# EAGLE design ultrasonic_send (EAGLE 6.1)
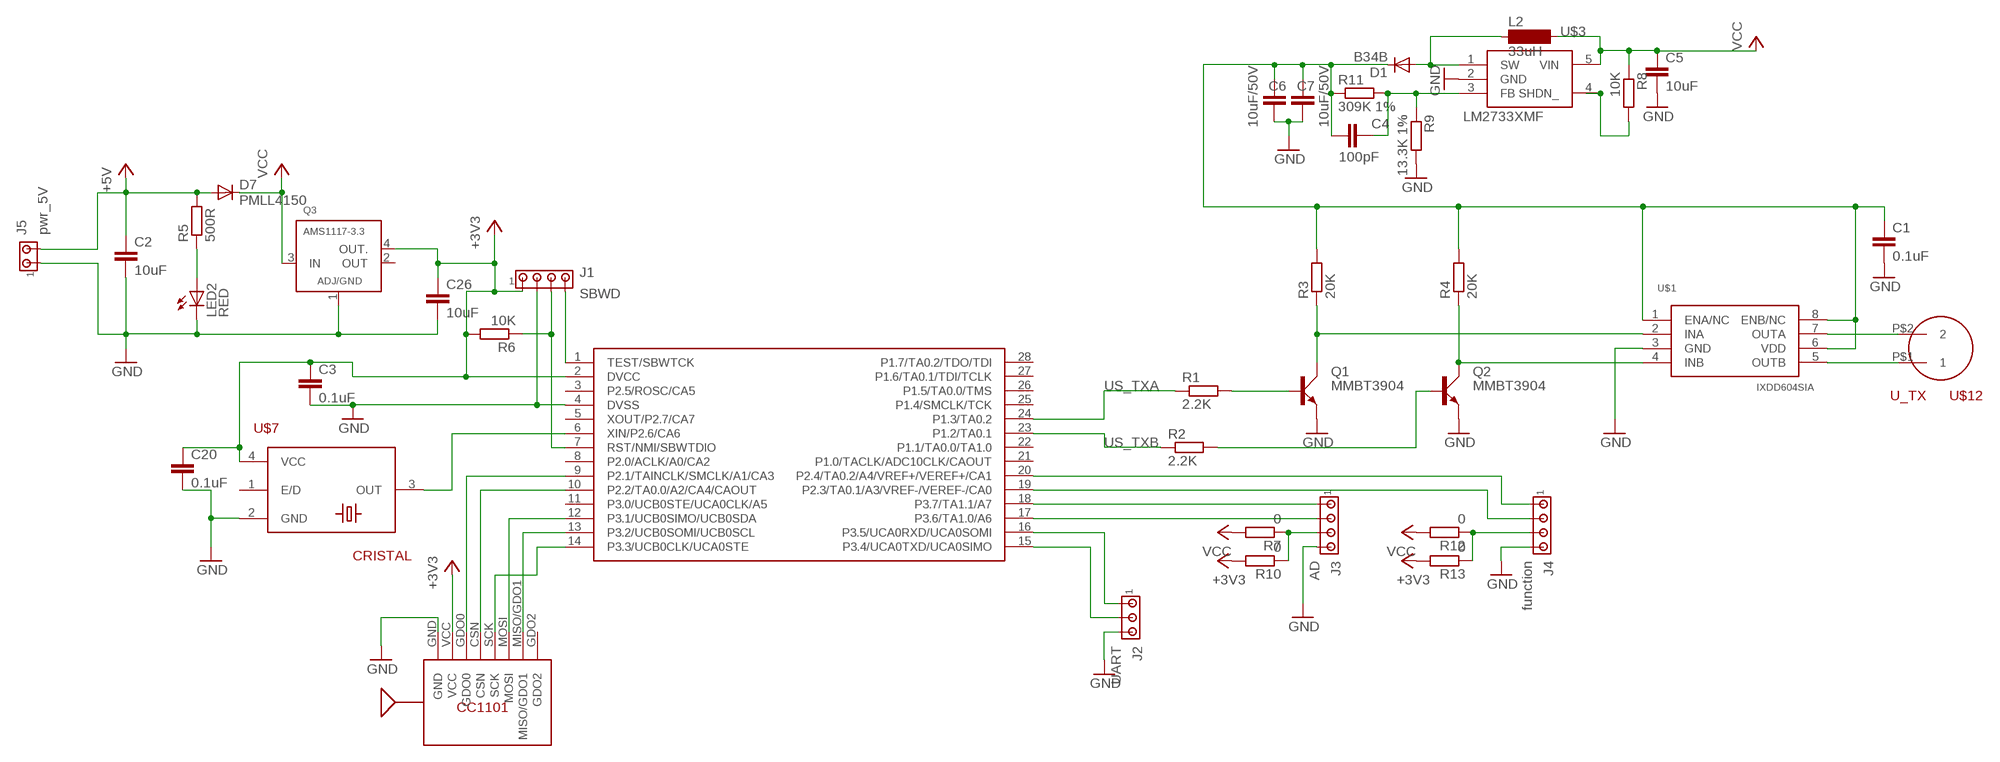
[diagram p0: schematic, sheet 1]

## Parts
C1  0.1uF  C-EUC0805  [C0805]
C2  10uF  C-EUC0805  [C0805]
C3  0.1uF  C-EUC0805  [C0805]
C4  100pF  C-EUC0805  [C0805]
C5  10uF  C-EUC0805  [C0805]
C6  10uF/50V  C-EUC1210  [C1210]
C7  10uF/50V  C-EUC1210  [C1210]
C20  0.1uF  C-EUC0805  [C0805]
C26  10uF  C-EUC0805  [C0805]
D1  B34B  DIODE-GF1  [GF1]
D7  PMLL4150  [SOD80C]
J1  SBWD  MTA04-100  [10X04MTA]
J2  UART  MTA03-100  [10X03MTA]
J3  AD  MTA04-100  [10X04MTA]
J4  function  MTA04-100  [10X04MTA]
J5  pwr_5V  MTA02-100  [10X02MTA]
L2  33uH  MS85  [MS85]
LED2  RED  LEDSML0805  [SML0805]
Q1  MMBT3904  [SOT23]
Q2  MMBT3904  [SOT23]
Q3  AMS1117-3.3  TLV1117  [SOT223-4]
R1  2.2K  R-EU_R0805  [R0805]
R2  2.2K  R-EU_R0805  [R0805]
R3  20K  R-EU_R0603  [R0603]
R4  20K  R-EU_R0603  [R0603]
R5  500R  R-EU_R0603  [R0603]
R6  10K  R-EU_R0603  [R0603]
R7  0  R-EU_R0603  [R0603]
R8  10K  R-EU_R0603  [R0603]
R9  13.3K 1%  R-EU_R0603  [R0603]
R10  0  R-EU_R0603  [R0603]
R11  309K 1%  R-EU_R0603  [R0603]
R12  0  R-EU_R0603  [R0603]
R13  0  R-EU_R0603  [R0603]
U$1  IXDD604SIA  [SO8]
U$2  MSP430F2112  [PW_R-PDSO-G28]
U$3  LM2733XMF  [SOT23-DBV]
U$4  CC1101  [CC1101]
U$7  CRISTAL  [CTS406]
U$12  U_TX  ULTRASONIC  [ULTRASONIC]

## Nets
+3V3: C3.1 C20.1 C26.1 J1.1 Q3.4(OUT.) R6.2 R10.2 R13.2 U$2.2(DVCC) U$4.VCC U$7.4(VCC)
+5V: C2.1 D7.A J5.2 R5.2
GND: C1.2 C2.2 C3.2 C5.2 C6.2 C7.2 C20.2 C26.2 J1.2 J2.3 J3.4 J4.4 J5.1 LED2.C Q1.2(E) Q2.2(E) Q3.1(ADJ/GND) R9.2 U$1.3(GND) U$2.4(DVSS) U$3.2(GND) U$4.GND U$7.2(GND)
N$1: Q1.1(B) R1.2
N$2: Q2.1(B) R2.2
N$3: Q1.3(C) R3.1 U$1.2(INA)
N$4: Q2.3(C) R4.1 U$1.4(INB)
N$5: J1.4 U$2.1(TEST/SBWTCK)
N$6: LED2.A R5.1
N$7: U$2.6(XIN/P2.6/CA6) U$7.3(OUT)
N$8: C1.1 C4.1 C6.1 C7.1 D1.C R3.2 R4.2 R11.1 U$1.1(ENA/NC) U$1.6(VDD) U$1.8(ENB/NC)
N$9: J4.3 R12.1 R13.1
N$10: J1.3 R6.1 U$2.7(RST/NMI/SBWTDIO)
N$11: U$2.9(P2.1/TAINCLK/SMCLK/A1/CA3) U$4.GDO0
N$12: U$2.10(P2.2/TA0.0/A2/CA4/CAOUT) U$4.CSN
N$13: U$2.12(P3.1/UCB0SIMO/UCB0SDA) U$4.MOSI
N$14: U$2.13(P3.2/UCB0SOMI/UCB0SCL) U$4.MISO/GDO1
N$15: U$2.14(P3.3/UCB0CLK/UCA0STE) U$4.SCK
N$16: J2.1 U$2.16(P3.5/UCA0RXD/UCA0SOMI)
N$17: J2.2 U$2.15(P3.4/UCA0TXD/UCA0SIMO)
N$18: J3.1 U$2.18(P3.7/TA1.1/A7)
N$19: J3.2 U$2.17(P3.6/TA1.0/A6)
N$20: J3.3 R7.1 R10.1
N$36: R8.2 U$3.4(SHDN_)
N$38: D1.A L2.1 U$3.1(SW)
N$39: C4.2 R9.1 R11.2 U$3.3(FB)
N$42: J4.1 U$2.20(P2.4/TA0.2/A4/VREF+/VEREF+/CA1)
N$54: U$1.7(OUTA) U$12.P$2
N$55: U$1.5(OUTB) U$12.P$1
N$56: J4.2 U$2.19(P2.3/TA0.1/A3/VREF-/VEREF-/CA0)
US_TXA: R1.1 U$2.24(P1.3/TA0.2)
US_TXB: R2.1 U$2.23(P1.2/TA0.1)
VCC: C5.1 D7.C L2.2 Q3.3(IN) R7.2 R8.1 R12.2 U$3.5(VIN)
Unconnected: U$2.3(P2.5/ROSC/CA5) U$2.5(XOUT/P2.7/CA7) U$2.8(P2.0/ACLK/A0/CA2) U$2.11(P3.0/UCB0STE/UCA0CLK/A5) U$2.21(P1.0/TACLK/ADC10CLK/CAOUT) U$2.22(P1.1/TA0.0/TA1.0) U$2.25(P1.4/SMCLK/TCK) U$2.26(P1.5/TA0.0/TMS) U$2.27(P1.6/TA0.1/TDI/TCLK) U$2.28(P1.7/TA0.2/TDO/TDI) U$4.GDO2 U$7.1(E/D)

## Power pins joined to a net without a drawn wire
OUT: Q3.2(OUT)

## Library data of the parts
C1-C7 C20 C26 = resistor:C-EU: CAPACITOR, European symbol
D1 = diode:DIODE-: DIODE
D7 = diode:PMLL4150: DIODE high speed
J1 J3 J4 = con-amp:MTA04-100: AMP connector
J2 = con-amp:MTA03-100: AMP connector
J5 = con-amp:MTA02-100: AMP connector
L2 = inductor-neosid:MS85: INDUCTOR SMD power inductor; OC_FARNELL: unknown; OC_NEWARK: unknown
LED2 = led:LED: LED OSRAM: - CHIPLED LG R971, LG N971, LY N971, LG Q971, LY Q971, LO R971, LY R971 LH N974, LH R974 LS Q976, LO Q976, LY Q976 LO Q996 - Hyper CHIPLED LW Q18S LB Q993, LB Q99A, LB R99A - SideLED LS A670, LO A670, LY A670, LG A670, LP A670 LB A673, LV A673, LT A673, LW A673 LH A674 LY A675 LS A676, LA A676, LO A676, LY A676, LW A676 LS A679, LY A679, LG A679 - Hyper Micro SIDELED® LS Y876, LA Y876, LO Y876, LY Y876 LT Y87S - SmartLED LW L88C, LW L88S LB L89C, LB L89S, LG L890 LS L89K, LO L89K, LY L89K LS L896, LA L896, LO L896, LY L896 - TOPLED LS T670, LO T670, LY T670, LG T670, LP T670 LSG T670, LSP T670, LSY T670, LOP T670, LYG T670 LG T671, LOG T671, LSG T671 LB T673, LV T673, LT T673, LW T673 LH T674 LS T676, LA T676, LO T676, LY T676, LB T676, LH T676, LSB T676, LW T676 LB T67C, LV T67C, LT T67C, LS T67K, LO T67K, LY T67K, LW E67C LS E67B, LA E67B, LO E67B, LY E67B, LB E67C, LV E67C, LT E67C LW T67C LS T679, LY T679, LG T679 LS T770, LO T770, LY T770, LG T770, LP T770 LB T773, LV T773, LT T773, LW T773 LH T774 LS E675, LA E675, LY E675, LS T675 LS T776, LA T776, LO T776, LY T776, LB T776 LHGB T686 LT T68C, LB T68C - Hyper Mini TOPLED® LB M676 - Mini TOPLED Santana® LG M470 LS M47K, LO M47K, LY M47K Source: http://www.osram.convergy.de LUXEON: - LUMILED® LXK2-PW12-R00, LXK2-PW12-S00, LXK2-PW14-U00, LXK2-PW14-V00 LXK2-PM12-R00, LXK2-PM12-S00, LXK2-PM14-U00 LXK2-PE12-Q00, LXK2-PE12-R00, LXK2-PE12-S00, LXK2-PE14-T00, LXK2-PE14-U00 LXK2-PB12-K00, LXK2-PB12-L00, LXK2-PB12-M00, LXK2-PB14-N00, LXK2-PB14-P00, LXK2-PB14-Q00 LXK2-PR12-L00, LXK2-PR12-M00, LXK2-PR14-Q00, LXK2-PR14-R00 LXK2-PD12-Q00, LXK2-PD12-R00, LXK2-PD12-S00 LXK2-PH12-R00, LXK2-PH12-S00 LXK2-PL12-P00, LXK2-PL12-Q00, LXK2-PL12-R00 Source: www.luxeon.com KINGBRIGHT: KA-3528ASYC Source: www.kingbright.com
Q1 Q2 = tofu:MMBT3904: NPN TRANSISTOR
Q3 = ti-parts:TLV1117: LDO VOLTAGE REGULATOR
R1-R13 = resistor:R-EU_: RESISTOR, European symbol
U$1 = tofu:IXDD604SIA: 4-Ampere Dual Low-Side Ultrafast MOSFET Drivers - Clare, Inc.
U$2 = tofu:MSP430F2112
U$3 = tofu:LM2733XMF: 0.6/1.6 MHz Boost Converters With 40V Internal FET Switch in SOT-23
U$4 = tofu:CC1101
U$7 = tofu:CRISTAL
U$12 = tofu:ULTRASONIC

## Board
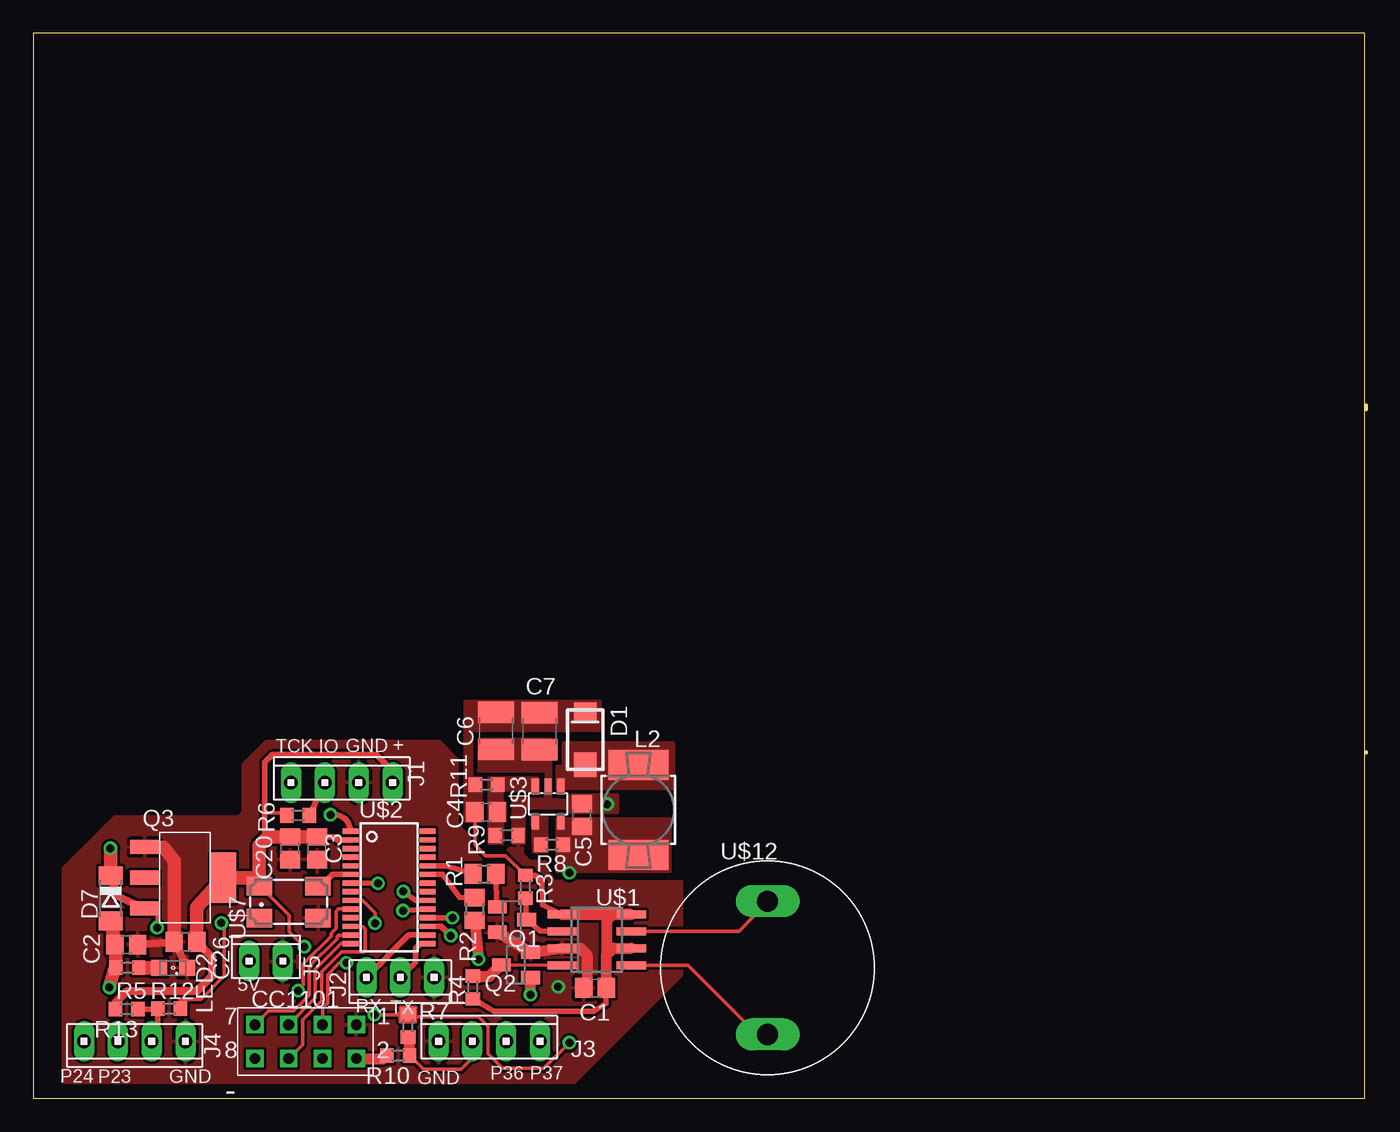
[diagram p1: board, top side]
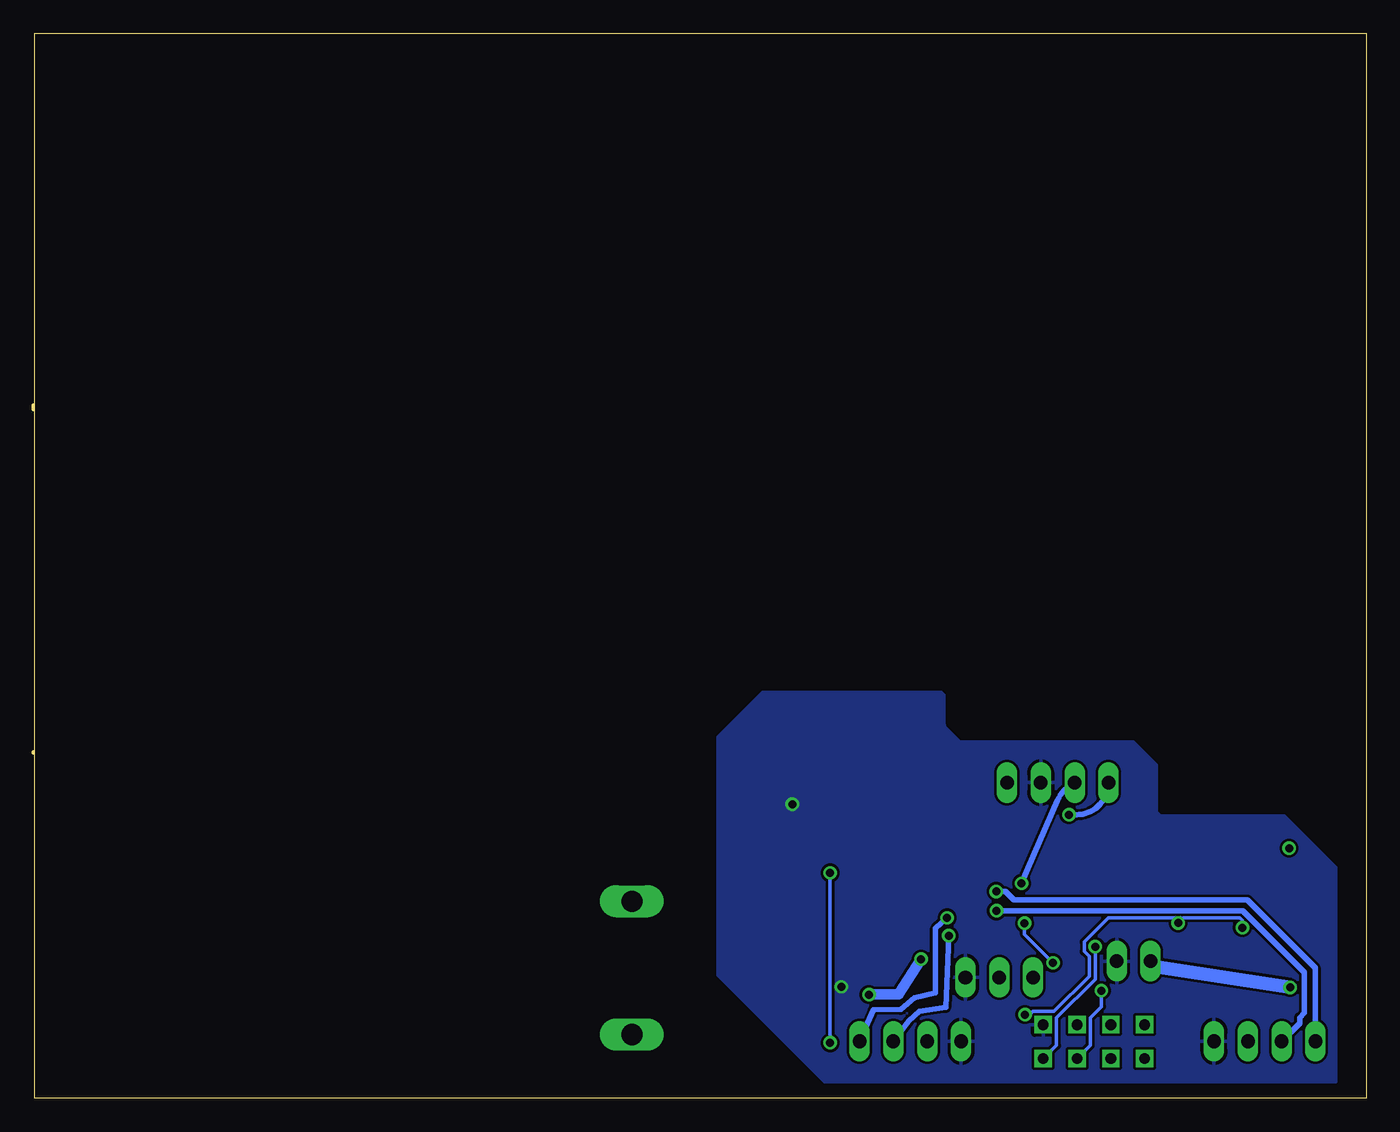
[diagram p2: board, bottom side, seen from below]

Size 100.1 x 80 mm. Coordinates in mm from the lower left corner, seen from the top.
Outline: 100.1,26.04 100.1,25.93
Outline: 100.1,51.74 100.1,52.07
Outline: 0,0 100,0 100,80 0,80 0,0
Copper layers (1*16): Top 0.035mm / dielectric 1.5mm / Bottom 0.035mm
Design rules "default *": minimum track width 10mil, minimum drill 10mil, track to track 8mil, track to pad 8mil, pad to pad 8mil, via to via 8mil, smd to smd 8mil, copper to edge 40mil, drill to drill 8mil, minimum pad ring 10mil, minimum via ring 8mil, stop-mask expansion 4mil, vias tented up to drill 20mil, thermal gap 10mil

### Footprints (pad centres in the part's own frame; a part is rotated, then mirrored left to right if it is on the bottom)
C0805 = smd 1.3 x 1.5: 1 -0.85,0; 2 0.85,0
C1210 = smd 1.6 x 2.7: 1 -1.4,0; 2 1.4,0
GF1 = smd 1.85 x 1.68: A 1.87,0 | smd 1.32 x 1.68: C -2.12,0
SOD80C = smd 1.4 x 1.8: A 1.7,0; C -1.7,0
10X04MTA = drill 1.016 long: 1 3.81,0; 2 1.27,0; 3 -1.27,0; 4 -3.81,0
10X03MTA = drill 1.016 long: 1 2.54,0; 2 0,0; 3 -2.54,0
10X02MTA = drill 1.016 long: 1 1.27,0; 2 -1.27,0
MS85 = smd 4.5 x 2.25: 1 0,-3.383; 2 0,3.383
SML0805 = smd 1.2 x 1.2: A 1.05,0; C -1.05,0
SOT23 = smd 1 x 1.4: 1 -0.95,-1.1; 2 0.95,-1.1; 3 0,1.1
SOT223-4 = smd 1.067 x 2.184: 1 -2.3,-3; 2 0,-3; 3 2.3,-3 | smd 3.81 x 1.93: 4 0,2.9
R0805 = smd 1.3 x 1.5: 1 -0.85,0; 2 0.85,0
R0603 = smd 1 x 1.1: 1 -0.85,0; 2 0.85,0
SO8 = smd 0.6 x 2.2: 1 -1.905,-2.6; 2 -0.635,-2.6; 3 0.635,-2.6; 4 1.905,-2.6; 5 1.905,2.6; 6 0.635,2.6; 7 -0.635,2.6; 8 -1.905,2.6
PW_R-PDSO-G28 = smd 0.4 x 1.2: 1 -4.225,-2.9; 2 -3.575,-2.9; 3 -2.925,-2.9; 4 -2.275,-2.9; 5 -1.625,-2.9; 6 -0.975,-2.9; 7 -0.325,-2.9; 8 0.325,-2.9; 9 0.975,-2.9; 10 1.625,-2.9; 11 2.275,-2.9; 12 2.925,-2.9; 13 3.575,-2.9; 14 4.225,-2.9; 15 4.225,2.9; 16 3.575,2.9; 17 2.925,2.9; 18 2.275,2.9; 19 1.625,2.9; 20 0.975,2.9; 21 0.325,2.9; 22 -0.325,2.9; 23 -0.975,2.9; 24 -1.625,2.9; 25 -2.275,2.9; 26 -2.925,2.9; 27 -3.575,2.9; 28 -4.225,2.9
SOT23-DBV = smd 0.55 x 1.2: 1 -0.95,-1.3; 2 0,-1.3; 3 0.95,-1.3; 4 0.95,1.3; 5 -0.95,1.3
CC1101 = drill 0.8 square: CSN -2.54,0; GDO0 -2.54,-2.54; GDO2 2.54,0; GND -5.08,-2.54; MISO/GDO1 2.54,-2.54; MOSI 0,0; SCK 0,-2.54; VCC -5.08,0
CTS406 = smd 1.9 x 1.4: 1 -2.2,-1.2; 2 2.2,-1.2; 3 2.2,1.2; 4 -2.2,1.2
ULTRASONIC = drill 1.6 long: P$1 -5,0; P$2 5,0

### Placement (x,y rotation side)
C1  42.19,8.31 180 top
C2  6.99,11.56 0 top
C3  21.31,18.8 270 top
C4  34.01,21.51 0 top
C5  41.2,21.29 90 top
C6  34.75,27.61 270 top
C7  38.02,27.58 270 top
C20  19.28,18.8 270 top
C26  11.43,11.76 180 top
D1  41.45,26.95 270 top
D7  5.82,15.04 270 top
J1  23.16,23.72 0 top
J2  27.56,9.09 180 top
J3  34.24,4.29 0 top
J4  7.62,4.29 180 top
J5  17.48,10.31 0 top
L2  45.44,21.67 180 top
LED2  10.49,9.8 180 top
Q1  35.94,13.44 270 top
Q2  36.25,10.03 90 top
Q3  11.38,16.59 270 top
R1  33.88,16.87 0 top
R2  33.15,14.22 270 top
R3  36.96,15.9 90 top
R4  33.02,8.33 270 top
R5  7.06,9.83 180 top
R6  19.89,21.26 180 top
R7  28.14,5.46 90 top
R8  38.96,19.08 180 top
R9  35.56,19.76 0 top
R10  27.41,3.23 180 top
R11  34.04,23.57 0 top
R12  10.21,6.76 0 top
R13  7.01,6.71 180 top
U$1  42.32,11.91 270 top
U$2  26.72,15.85 270 top
U$3  38.66,22.12 180 top
U$4  19.18,3 180 top
U$7  19.18,14.76 0 top
U$12  55.14,9.8 90 top

### Tracks (layer width: path | path; a pad name or v marks a point on that pad's centre or on a via)
+3V3  (via drill 0.6)
  Top 0.254: v20.34,11.4 19.23,12.52 19.23,13.74 17.35,15.62 U$7.4 | 17.37,21.44 18.69,21.44 R6.2
  Top 0.406: C3.1 22.62,19.65 22.89,19.38 23.78,19.38 U$2.2 | J1.1 26.98,24.59 25.73,25.83 17.98,25.83 17.37,25.22 17.37,21.44 17.37,19.86 17.6,19.63
  Top 0.61: R13.2 6.16,7.18 7.06,8.08 12.32,8.08 13.44,9.2 13.44,10.6 C26.1
  Top 0.813: U$4.VCC 26.33,3 R10.2
  Top 1.016: C26.1 12.27,14.35 Q3.4 16.35,16.59 U$7.4 16.98,19.01 17.6,19.63 19.27,19.63 C20.1 C3.1
  Bottom 0.254: v20.34,11.4 20.34,8.97 23.27,6.04 23.27,3.99 U$4.VCC
+5V  (via drill 0.6)
  Top 1.016: D7.A C2.1 R5.2 6.16,9.88 v5.71,8.33
  Bottom 1.016: v5.71,8.33 15.77,9.88 J5.2
GND  (via drill 0.6)
  Top 0.61: C2.2 C26.2 LED2.C
  Top 0.813: C1.2 41.58,8.55 41.58,10.79 41.1,11.28 U$1.3 Q2.2 Q1.2
  Top 1.016: Q3.1 9.78,18.87 10.57,17.86 C26.2
  other vias: 39.42,8.38 43.1,22.1
  pour Top (no thermals): 43.87,21.49 43.87,22.78 41.96,22.78 41.96,22.81 40.41,22.81 40.23,22.61 40.06,22.38 38.86,22.45 38.86,26.95 38.79,26.95 38.79,26.97 33.53,27 33.48,25.17 33.53,25.25 33.45,24.61 38.53,24.56 38.48,22.45 38.25,22.48 38.25,22.45 36.04,22.45 36.04,19.15 36.86,19.15 36.86,21.79 40.08,21.82 40.31,21.51 40.36,21.51 40.36,21.49
  pour Bottom: 2.31,1.24 40.69,1.24 48.69,9.25 48.69,27.15 45.34,30.51 31.9,30.51 31.7,30.3 31.7,28.07 31.67,28.04 31.67,27.94 30.51,26.77 17.5,26.77 15.77,25.04 15.77,21.54 15.44,21.21 6.15,21.21 2.29,17.35 2.29,1.27
  pour Top: 2.34,1.22 40.64,1.22 48.67,9.25 48.67,16.26 48.34,16.26 39.12,16.33 38.46,17.17 38.48,17.78 37.24,17.83 36.7,18.36 36.83,19.79 36.86,21.77 36.02,21.77 36.02,19.02 35.53,18.54 33.86,18.54 31.83,20.57 31.83,25.48 30.51,26.8 17.48,26.8 15.77,25.1 15.77,21.51 15.42,21.16 6.12,21.16 2.24,17.27 2.24,1.32
N$1
  Top 0.406: R1.2 Q1.1
N$2  (via drill 0.6)
  Top 0.813: R2.2 v33.43,10.46 | v37.34,7.8 Q2.1
  Bottom 0.813: v33.43,10.46 35.13,7.82 v37.34,7.8
N$3
  Top 0.406: R3.1 Q1.3 38.08,12.6 U$1.2
N$4
  Top 0.254: Q2.3 U$1.4
  Top 0.813: R4.1 34.24,9.17 Q2.3
N$5  (via drill 0.6)
  Top 0.406: v22.33,21.31 22.59,21.31 arc-90 U$2.1
  Bottom 0.406: v22.33,21.31 21.77,21.31 arc-90 J1.4
N$6
  Top 1.016: R5.1 LED2.A
N$7
  Top 0.406: U$7.3 21.62,15.96 22.48,16.82 U$2.6
N$8
  Top 0.254: C4.1 33.16,19.06 33.98,18.24 35.47,18.24 R3.2
  Top 0.406: R4.2 34.62,6.55 42.06,6.55 43.03,7.14 C1.1 | R3.2 37.72,16.74 38.2,16.28 38.23,14.55 U$1.1
  Top 0.813: C1.1 43.04,10.78 43.05,10.79 | 43.05,10.79 43.54,11.28 U$1.6 | U$1.1 U$1.8 43.51,13.82 43.05,13.36 43.05,10.79
  pour Top (no thermals): 42.55,29.82 42.55,27.64 32.92,27.64 32.92,24.08 33.63,24.08 33.63,20.83 32.44,20.83 32.44,29.82
N$9
  Top 0.406: R13.1 9.31,6.71 R12.1 9.36,4.76 J4.3
N$10  (via drill 0.6)
  Top 0.406: R6.1 J1.3 | v25.88,16.15 U$2.7
  Bottom 0.406: v25.88,16.15 23.19,22.38 arc41 J1.3
N$11  (via drill 0.6)
  Top 0.254: v25.65,13.16 25.65,13.95 24.71,14.88 23.82,14.88 U$2.9 | v23.52,10.19 22.99,10.19 22.1,9.3 22.1,7.14 21.72,6.76 U$4.GDO0
  Bottom 0.254: v25.65,13.16 25.65,12.32 v23.52,10.19
N$12  (via drill 0.6)
  Top 0.254: v19.89,8.1 20.27,8.48 20.27,10.11 22.35,12.19 22.35,12.37 22.48,12.5 22.48,12.52 22.73,12.78 22.73,14.05 22.91,14.22 23.8,14.22 U$2.10
  Bottom 0.254: v19.89,8.1 19.89,6.88 20.73,6.04 20.73,3.99 U$4.CSN
N$13
  Top 0.254: U$2.12 24.51,12.93 24.54,12.9 24.77,12.9 24.92,12.75 24.92,11.15 24.79,11.02 23.16,11.02 21.64,9.5 21.64,7.34 20.22,5.92 20.22,4.04 U$4.MOSI
N$14
  Top 0.254: U$4.MISO/GDO1 17.68,6.58 19.56,6.58 20.73,7.75 20.73,9.91 22.81,11.99 22.81,12.17 22.91,12.27 23.8,12.27 U$2.13
N$15
  Top 0.254: U$2.14 23.8,11.63 23.11,11.63 21.18,9.7 21.18,7.54 U$4.SCK
N$16
  Top 0.406: U$2.16 28.2,12.28 J2.1
N$17
  Top 0.406: U$2.15 29.05,11.62 28.7,11.28 28.7,10.24 J2.2
N$18  (via drill 0.6)
  Top 0.406: U$2.18 30.76,13.56 v31.47,13.56
  Bottom 0.406: J3.1 37.01,6.66 34.95,6.68 33.93,7.54 32.33,7.95 32.33,12.78 v31.47,13.56
N$19  (via drill 0.6)
  Top 0.406: U$2.17 30.61,12.93 v31.34,12.22
  Bottom 0.406: v31.34,12.22 31.57,6.83 33.55,6.55 34.34,5.84 J3.2
N$20
  Top 0.254: J3.3 32.97,3.02 32.13,2.18 29.3,2.18 R10.1
  Top 0.813: R10.1 28.26,4.5 R7.1
N$36
  pour Top (no thermals): 38.53,21.26 38.58,18.52 37.57,18.49 37.49,20.98 37.49,21.26
N$38
  pour Top (no thermals): 39.34,23.16 39.34,23.29 48.08,23.29 48.08,26.72 39.83,26.72 39.83,24.94 39.32,24.94 39.32,23.16
N$39
  pour Top (no thermals): 37.85,24.08 37.87,23.27 37.85,23.09 37.47,23.09 35.2,23.19 35.23,19.15 34.24,19.13 34.24,24.13
N$42  (via drill 0.6)
  Top 0.406: U$2.20 28.7,14.88 v27.79,15.54
  Bottom 0.406: v27.79,15.54 27.1,15.54 26.47,14.91 8.91,14.91 3.83,9.83 3.83,4.32 J4.1
N$54
  Top 0.254: U$1.7 52.98,12.55 54.25,13.82 U$12.P$2
N$55
  Top 0.254: U$1.5 49.17,10.01 54.25,4.93 U$12.P$1
N$56  (via drill 0.6)
  Top 0.406: U$2.19 v27.76,14.1
  Bottom 0.406: v27.76,14.1 9.27,14.1 4.65,9.47 4.65,6.43 5,6.07 5,5.64 J4.2
US_TXA
  Top 0.406: U$2.24 31,17.48 R1.1
US_TXB
  Top 0.406: U$2.23 30.73,16.82 32.03,15.09 R2.1
VCC  (via drill 0.6)
  Top 0.254: R12.2 11.05,6.76 11.05,7.42 11.07,7.44 12.6,7.44 14.35,9.2 14.35,13.41 v14.12,13.18 | v9.3,12.83 9.3,14.05 9.07,14.28 8.69,14.28 Q3.3 | R7.2 27.51,6.3 27.48,6.33 27.48,6.4 27.58,6.4 27.58,6.86 28.73,6.86 28.73,6.15 | 28.73,6.15 28.73,5.77 27.56,5.77 27.56,6.3 v25.63,6.3 | v40.26,4.19 38.33,2.26 35.23,2.26 34.14,3.35 34.14,5.44 33.43,6.15 28.73,6.15 | v40.26,16.94 40.26,17.04
  Top 0.61: D7.C 6.22,15.24 Q3.3
  Top 1.016: D7.C 5.82,18.77 v5.79,18.8
  Bottom 0.254: v9.3,12.83 9.3,13.36 9.5,13.56 13.74,13.56 v14.12,13.18 13.92,13.56 19.38,13.56 21.18,11.76 21.18,11.05 20.8,10.67 20.8,9.17 23.44,6.53 25.04,6.53 25.27,6.3 v25.63,6.3 | v40.26,16.94 v40.26,4.19
  pour Top (no thermals): 47.8,17.04 39.32,17.04 39.34,21.01 47.8,21.01

### Text on the board
tNames: + | TCK | IO | GND | 5V | RX | TX | P24 | P23 | - | GND | GND | P36 | P37
_tNames: D7 | L2 | Q3 | D1 | C5 | J1 | R8 | U$3 | C7 | C3 | U$2 | C2 | C26 | R9 | R26 | U$7 | C4 | R5 | LED2 | C6 | R11 | R25 | C1 | C20 | Q1 | R24 | R1 | R3 | U$1 | J5 | R23 | LED4 | R21 | C15 | Q2 | J4 | R22 | R28 | R2 | R27 | C17 | R4 | U$12
_bNames: U$9